# EAGLE design LogicBoard-Pico (EAGLE 9.6.2)
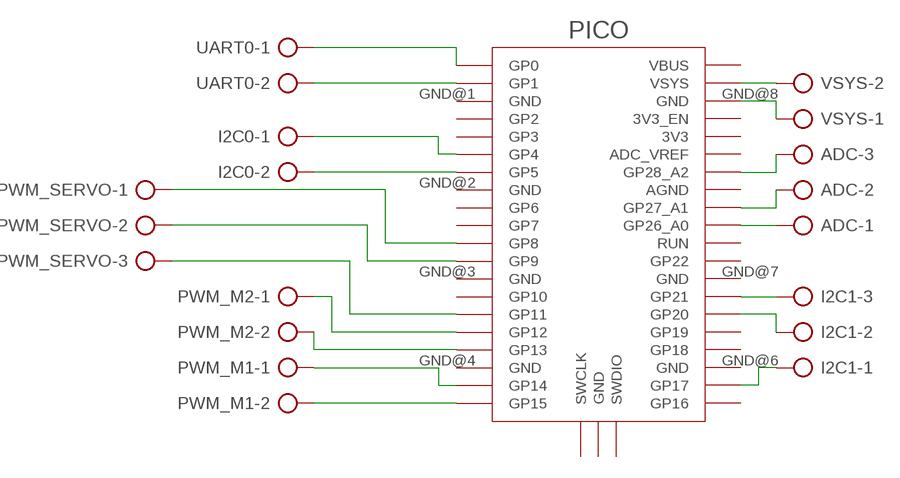
[diagram p0: schematic, sheet 1]

## Parts
ADC  AK500/3  [AK500/3]
I2C0  AK500/2  [AK500/2]
I2C1  AK500/3  [AK500/3]
PICO  RPI_PICO_IG-TH  [RPI_PICO_TH]
PWM_M1  AK500/2  [AK500/2]
PWM_M2  AK500/2  [AK500/2]
PWM_SERVO  AK500/3  [AK500/3]
UART0  AK500/2  [AK500/2]
VSYS  AK500/2  [AK500/2]

## Nets
N$1: PICO.GND@8(GND) VSYS.1
N$2: PICO.VSYS VSYS.2
N$3: ADC.3 PICO.GP28_A2
N$4: ADC.2 PICO.GP27_A1
N$5: ADC.1 PICO.GP26_A0
N$6: I2C1.3 PICO.GP21
N$7: I2C1.2 PICO.GP20
N$8: PICO.GP0 UART0.1
N$9: PICO.GP1 UART0.2
N$10: I2C0.1 PICO.GP4
N$11: I2C0.2 PICO.GP5
N$12: PICO.GP15 PWM_M1.2
N$13: PICO.GP14 PWM_M1.1
N$14: PICO.GP13 PWM_M2.2
N$15: PICO.GP12 PWM_M2.1
N$16: PICO.GP11 PWM_SERVO.3
N$17: PICO.GP9 PWM_SERVO.2
N$18: PICO.GP8 PWM_SERVO.1
N$19: I2C1.1 PICO.GP17
Unconnected: PICO.3V3 PICO.3V3_EN PICO.ADC_VREF PICO.AGND PICO.GND@1(GND) PICO.GND@2(GND) PICO.GND@3(GND) PICO.GND@4(GND) PICO.GND@5(GND) PICO.GND@6(GND) PICO.GND@7(GND) PICO.GP2 PICO.GP3 PICO.GP6 PICO.GP7 PICO.GP10 PICO.GP16 PICO.GP18 PICO.GP19 PICO.GP22 PICO.RUN PICO.SWCLK PICO.SWDIO PICO.VBUS

## Library data of the parts
ADC I2C1 PWM_SERVO = con-ptr500:AK500/3: CONNECTOR; OC_FARNELL: unknown; OC_NEWARK: unknown
I2C0 PWM_M1 PWM_M2 UART0 VSYS = con-ptr500:AK500/2: CONNECTOR; OC_FARNELL: unknown; OC_NEWARK: unknown
PICO = RaspberryPi_Pico:RPI_PICO_IG

## Board
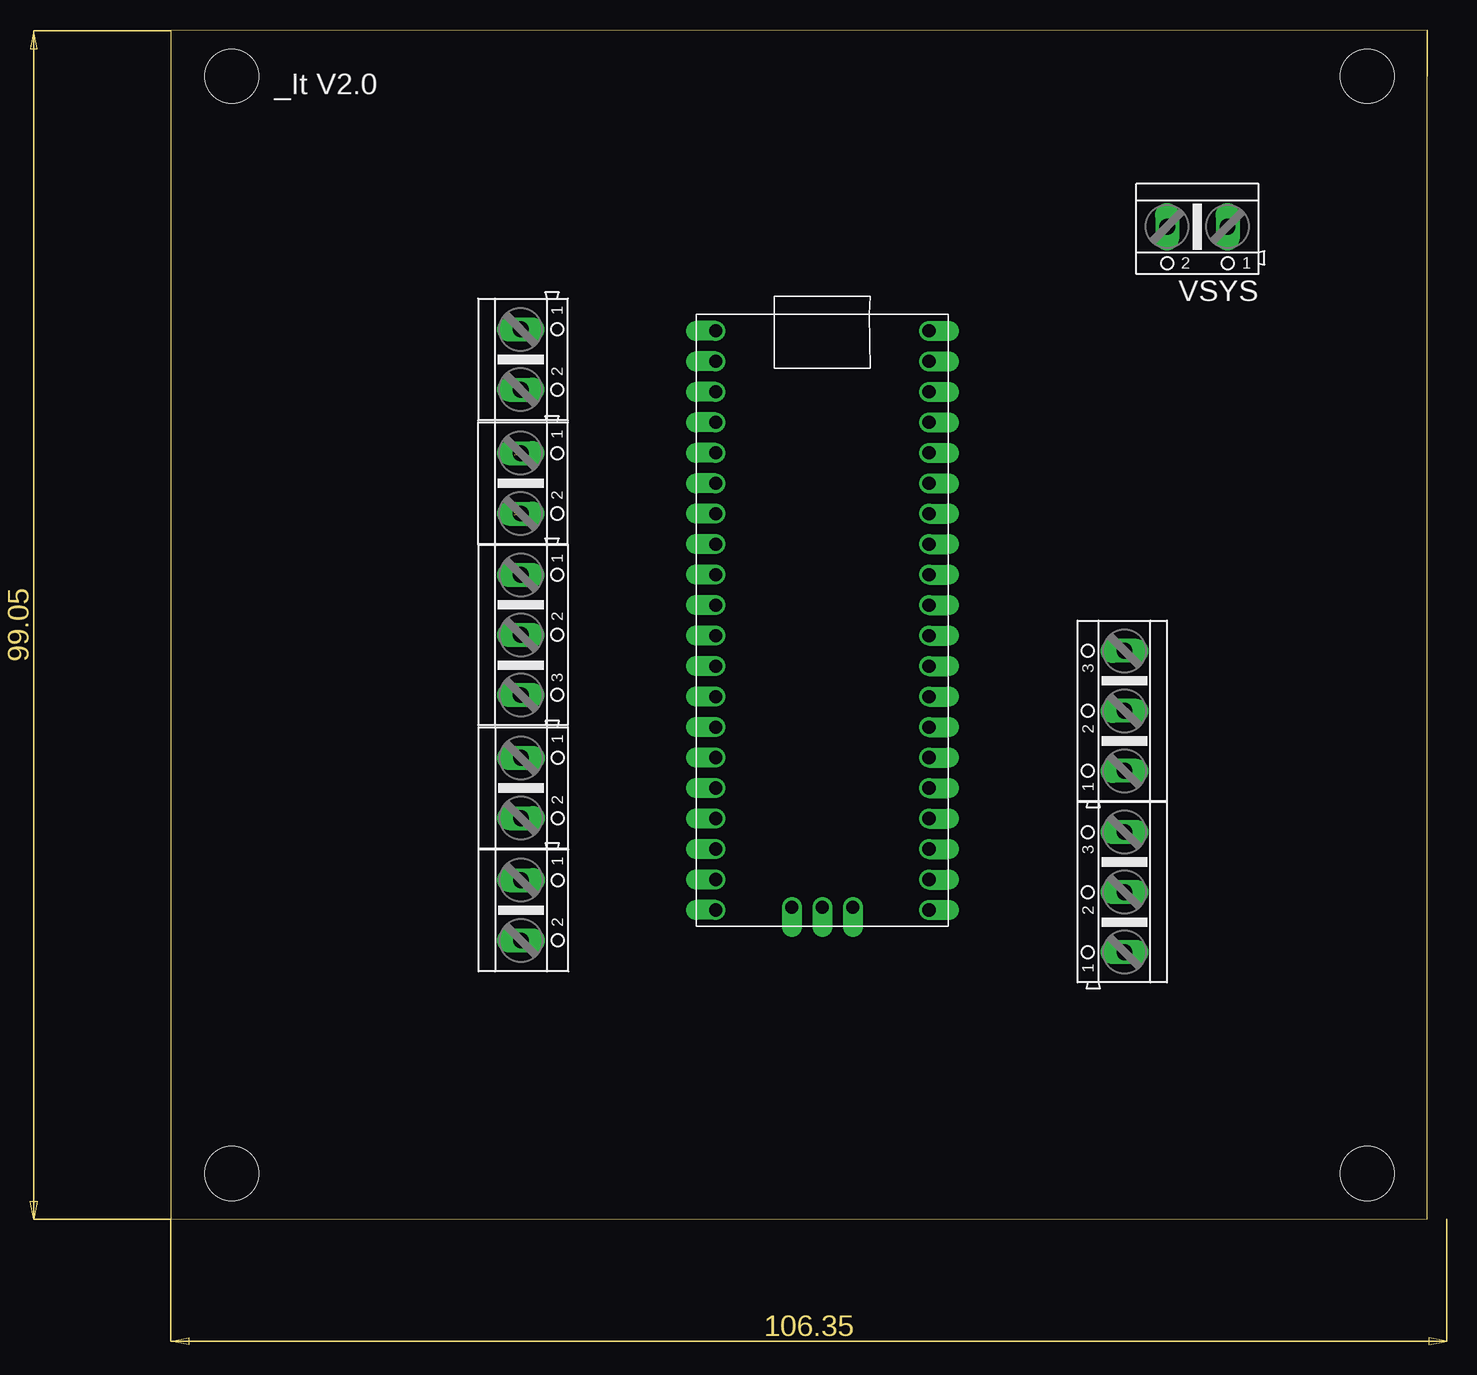
[diagram p1: board, top side]
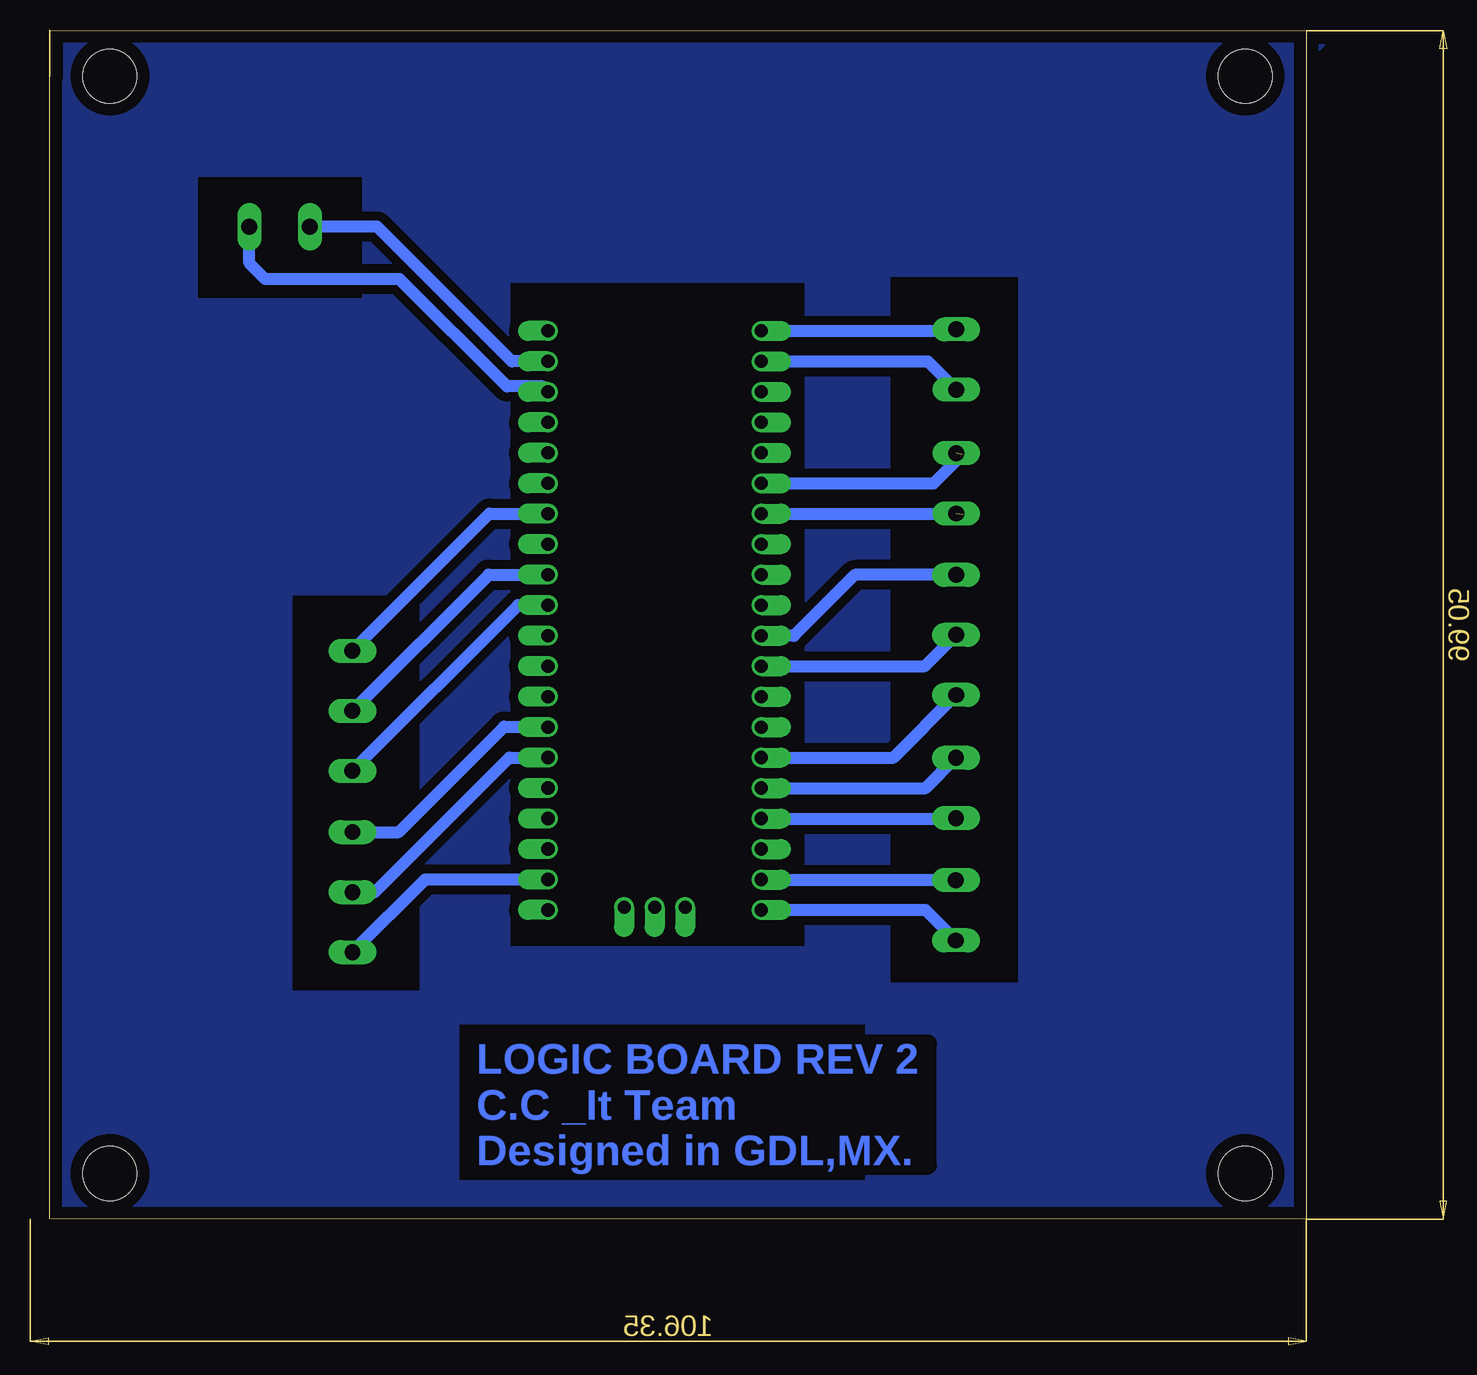
[diagram p2: board, bottom side, seen from below]

Size 104.7 x 99.1 mm. Coordinates in mm from the lower left corner, seen from the top.
Outline: 0,0 104.7,0.05 104.7,99.1 0,99.05 0,0
Copper layers (1*16): Top 0.035mm / dielectric 1.5mm / Bottom 0.035mm
Design rules "default *": minimum track width 0.75mm, minimum drill 0.35mm, track to track 0.75mm, track to pad 0.75mm, pad to pad 6mil, via to via 6mil, smd to smd 6mil, copper to edge 40mil, drill to drill 6mil, minimum pad ring 10mil, minimum via ring 8mil, stop-mask expansion 4mil, vias tented up to drill 0mil, thermal gap 10mil
Holes 4.5 mm at 5.08,3.81 5.08,95.25 99.69,95.25 99.69,3.81
bRestrict: area 24.1,19.7 to 34.6,78.5; area 73.9,19.1 to 84.5,51.9; area 78.7,76.8 to 92.3,86.8; area 41.8,22.8 to 66.3,78; area 36.8,3.3 to 70.5,16.2

### Footprints (pad centres in the part's own frame; a part is rotated, then mirrored left to right if it is on the bottom)
AK500/3 = drill 1.321 long: 1 -5.004,0; 2 0,0; 3 5.004,0
AK500/2 = drill 1.321 long: 1 -2.515,0; 2 2.515,0
RPI_PICO_TH = drill 1.1 pad 1.6 offset: 3V3 8.89,13.97; 3V3_EN 8.89,16.51; ADC_VREF 8.89,11.43; AGND 8.89,6.35; GND@1 -8.89,19.05; GND@2 -8.89,6.35; GND@3 -8.89,-6.35; GND@4 -8.89,-19.05; GND@5 0,-23.9; GND@6 8.89,-19.05; GND@7 8.89,-6.35; GND@8 8.89,19.05; GP0 -8.89,24.13; GP1 -8.89,21.59; GP2 -8.89,16.51; GP3 -8.89,13.97; GP4 -8.89,11.43; GP5 -8.89,8.89; GP6 -8.89,3.81; GP7 -8.89,1.27; GP8 -8.89,-1.27; GP9 -8.89,-3.81; GP10 -8.89,-8.89; GP11 -8.89,-11.43; GP12 -8.89,-13.97; GP13 -8.89,-16.51; GP14 -8.89,-21.59; GP15 -8.89,-24.13; GP16 8.89,-24.13; GP17 8.89,-21.59; GP18 8.89,-16.51; GP19 8.89,-13.97; GP20 8.89,-11.43; GP21 8.89,-8.89; GP22 8.89,-3.81; GP26_A0 8.89,1.27; GP27_A1 8.89,3.81; GP28_A2 8.89,8.89; RUN 8.89,-1.27; SWCLK -2.54,-23.9; SWDIO 2.54,-23.9; VBUS 8.89,24.13; VSYS 8.89,21.59

### Placement (x,y rotation side)
ADC  79.48,42.37 90 top
I2C0  29.16,61.32 270 top
I2C1  79.48,27.26 90 top
PICO  54.3,49.9 0 top
PWM_M1  29.19,25.74 270 top
PWM_M2  29.19,35.93 270 top
PWM_SERVO  29.17,48.69 270 top
UART0  29.16,71.64 270 top
VSYS  85.55,82.71 180 top

### Tracks (layer width: path | path; a pad name or v marks a point on that pad's centre or on a via)
N$1
  Bottom 1.016: PICO.GND@8 63.64,69.4 66.62,69.4 75.56,78.35 86.73,78.35 88.07,79.68 VSYS.1
N$2
  Bottom 1.016: PICO.VSYS 66.2,71.49 77.43,82.71 VSYS.2
N$3
  Bottom 1.016: ADC.3 68.06,58.79 PICO.GP28_A2
N$4
  Bottom 1.016: ADC.2 68.14,53.71 PICO.GP27_A1
N$5
  Bottom 1.016: ADC.1 65.68,51.17 PICO.GP26_A0
N$6
  Bottom 1.016: I2C1.3 75.63,32.26 66.85,41.04 63.22,41.04 PICO.GP21
N$7
  Bottom 1.016: I2C1.2 77.61,27.26 66.4,38.47 PICO.GP20
N$8
  Bottom 1.016: PICO.GP0 29.29,74.03 UART0.1
N$9
  Bottom 1.016: PICO.GP1 31.52,71.49 UART0.2
N$10  (1 unrouted)
  Bottom 1.016: PICO.GP4 31.05,61.33 28.66,63.72
N$11  (1 unrouted)
  Bottom 1.016: PICO.GP5 28.72,58.79 28.62,58.68
N$12
  Bottom 1.016: PICO.GP15 31.73,25.77 PWM_M1.2
N$13
  Bottom 1.016: PICO.GP14 29.24,28.31 PWM_M1.1
N$14
  Bottom 1.016: PICO.GP13 29.22,33.39 PWM_M2.2
N$15
  Bottom 1.016: PICO.GP12 31.71,35.93 PWM_M2.1
N$16
  Bottom 1.016: PICO.GP11 34.39,38.47 PWM_SERVO.3
N$17
  Bottom 1.016: PICO.GP9 31.77,46.09 PWM_SERVO.2
N$18  (via drill 0.35)
  Bottom 0.75: v29.25,53.25 PWM_SERVO.1
  Bottom 1.016: PWM_SERVO.1 37.62,53.69 42.7,48.61 45.39,48.61 PICO.GP8
N$19
  Bottom 1.016: PICO.GP17 73.42,28.31 I2C1.1
N$20
  pour Bottom: -2.77,99.09 104.75,99.09 104.81,99.15 104.81,0.25 104.68,0.13 0.38,0.13 0.13,-0.13 0.13,96.21 -2.75,99.09 -2.75,99.09

### Text on the board
Bottom: LOGIC BOARD REV 2 / C.C _It Team / Designed in GDL,MX.
tPlace: _It V2.0